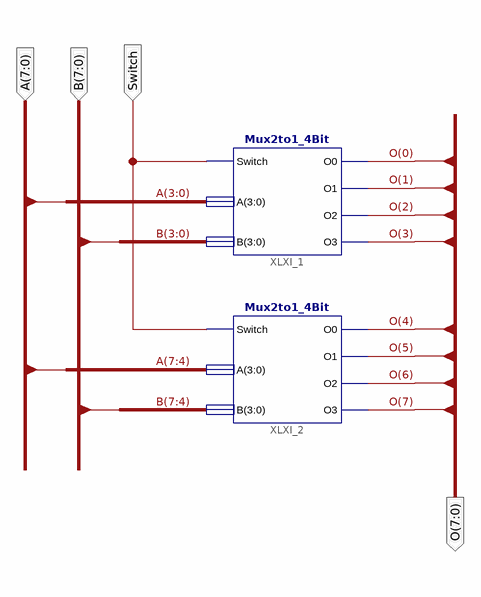
[diagram p0: schematic sheet 1]
// Xilinx ISE schematic Mux2to1_8Bit.sch (spartan3e) as structural Verilog: 2 symbols, 4 ports
module Mux2to1_8Bit (
  input  Switch,
  input  [7:0] B,
  input  [7:0] A,
  output [7:0] O
);

  Mux2to1_4Bit XLXI_1 (.O0(O[0]), .O1(O[1]), .O2(O[2]), .O3(O[3]), .B(B[3:0]), .Switch(Switch), .A(A[3:0]));
  Mux2to1_4Bit XLXI_2 (.O0(O[4]), .O1(O[5]), .O2(O[6]), .O3(O[7]), .B(B[7:4]), .Switch(Switch), .A(A[7:4]));
endmodule
